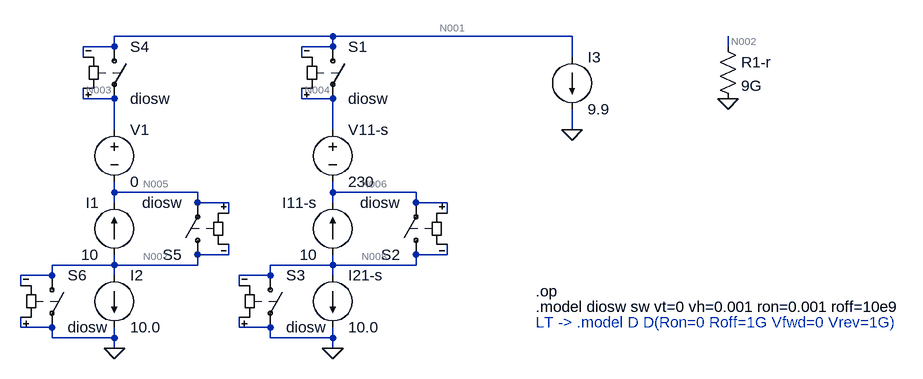
[diagram p0: schematic Generator-Test.asc]
Generator-Test.asc, the LTspice schematic file:
Version 4
SHEET 1 1272 680
WIRE 256 -64 -80 -64
WIRE 624 -64 256 -64
WIRE -80 -48 -80 -64
WIRE -80 -48 -128 -48
WIRE 256 -48 256 -64
WIRE 256 -48 208 -48
WIRE 864 -48 864 -64
WIRE -128 -32 -128 -48
WIRE 208 -32 208 -48
WIRE 624 -32 624 -64
WIRE -128 32 -128 16
WIRE -80 32 -128 32
WIRE 208 32 208 16
WIRE 256 32 208 32
WIRE -80 80 -80 32
WIRE 256 80 256 32
WIRE 624 80 624 48
WIRE -80 176 -80 160
WIRE 48 176 -80 176
WIRE 256 176 256 160
WIRE 384 176 256 176
WIRE -80 192 -80 176
WIRE 48 192 48 176
WIRE 96 192 48 192
WIRE 256 192 256 176
WIRE 384 192 384 176
WIRE 432 192 384 192
WIRE 96 208 96 192
WIRE 432 208 432 192
WIRE 96 272 96 256
WIRE 96 272 48 272
WIRE 432 272 432 256
WIRE 432 272 384 272
WIRE -80 288 -80 272
WIRE -80 288 -176 288
WIRE 48 288 48 272
WIRE 48 288 -80 288
WIRE 256 288 256 272
WIRE 256 288 160 288
WIRE 384 288 384 272
WIRE 384 288 256 288
WIRE -176 304 -176 288
WIRE -176 304 -224 304
WIRE -80 304 -80 288
WIRE 160 304 160 288
WIRE 160 304 112 304
WIRE 256 304 256 288
WIRE -224 320 -224 304
WIRE 112 320 112 304
WIRE -224 384 -224 368
WIRE -176 384 -224 384
WIRE 112 384 112 368
WIRE 160 384 112 384
WIRE -176 400 -176 384
WIRE -80 400 -80 384
WIRE -80 400 -176 400
WIRE 160 400 160 384
WIRE 256 400 256 384
WIRE 256 400 160 400
WIRE -80 416 -80 400
WIRE 256 416 256 400
FLAG 256 416 0
FLAG 624 80 0
FLAG -80 416 0
FLAG 864 32 0
DATAFLAG 384 -64 ""
SYMBOL current 256 272 R180
WINDOW 0 24 80 Left 2
WINDOW 3 24 0 Left 2
WINDOW 123 0 0 Left 0
WINDOW 39 0 0 Left 0
SYMATTR InstName I11-s
SYMATTR Value 10
SYMBOL voltage 256 64 R0
WINDOW 123 0 0 Left 0
WINDOW 39 0 0 Left 0
SYMATTR InstName V11-s
SYMATTR Value 230
SYMBOL current 256 304 R0
WINDOW 123 0 0 Left 0
WINDOW 39 0 0 Left 0
SYMATTR InstName I21-s
SYMATTR Value 10.0
SYMBOL res 848 -64 R0
SYMATTR InstName R1-r
SYMATTR Value 9G
SYMBOL sw 256 -64 R0
SYMATTR InstName S1
SYMATTR Value diosw
SYMBOL sw 384 288 R180
SYMATTR InstName S2
SYMATTR Value diosw
SYMBOL sw 160 288 R0
SYMATTR InstName S3
SYMATTR Value diosw
SYMBOL current -80 272 R180
WINDOW 0 24 80 Left 2
WINDOW 3 24 0 Left 2
WINDOW 123 0 0 Left 0
WINDOW 39 0 0 Left 0
SYMATTR InstName I1
SYMATTR Value 10
SYMBOL voltage -80 64 R0
WINDOW 123 0 0 Left 0
WINDOW 39 0 0 Left 0
SYMATTR InstName V1
SYMATTR Value 0
SYMBOL current -80 304 R0
WINDOW 123 0 0 Left 0
WINDOW 39 0 0 Left 0
SYMATTR InstName I2
SYMATTR Value 10.0
SYMBOL sw -80 -64 R0
SYMATTR InstName S4
SYMATTR Value diosw
SYMBOL sw 48 288 R180
SYMATTR InstName S5
SYMATTR Value diosw
SYMBOL sw -176 288 R0
SYMATTR InstName S6
SYMATTR Value diosw
SYMBOL current 624 -32 R0
WINDOW 123 0 0 Left 0
WINDOW 39 0 0 Left 0
SYMATTR InstName I3
SYMATTR Value 9.9
TEXT 568 328 Left 2 !.op
TEXT 568 352 Left 2 !.model diosw sw vt=0 vh=0.001 ron=0.001 roff=10e9
TEXT 568 376 Left 2 ;LT -> .model D D(Ron=0 Roff=1G Vfwd=0 Vrev=1G)

The netlist it stands for:
* Generator-Test.asc
I11-s N008 N006 10
V11-s N004 N006 230
I21-s N008 0 10.0
R1-r N002 0 9G
S1 N001 N004 N004 N001 diosw
S2 N008 N006 N006 N008 diosw
S3 N008 0 0 N008 diosw
I1 N007 N005 10
V1 N003 N005 0
I2 N007 0 10.0
S4 N001 N003 N003 N001 diosw
S5 N007 N005 N005 N007 diosw
S6 N007 0 0 N007 diosw
I3 N001 0 9.9
.op
.model diosw sw vt=0 vh=0.001 ron=0.001 roff=10e9
* LT -> .model D D(Ron=0 Roff=1G Vfwd=0 Vrev=1G)
.backanno
.end

* Results of the author's LTspice run, read from the files saved beside the schematic
* Operating Point:
*   V(n008) = -19.9 mV
*   V(n006) = -19.8 mV
*   V(n004) = 230 V
*   V(n002) = 0 V
*   V(n001) = 230 V
*   V(n007) = -10 mV
*   V(n005) = 46.45 pV
*   V(n003) = 46.45 pV
*   I(I3) = 9.9 A
*   I(I2) = 10 A
*   I(I1) = 10 A
*   I(I21-s) = 10 A
*   I(I11-s) = 10 A
*   I(R1-r) = 0 A
*   I(S6) = 10 A
*   I(S5) = 10 A
*   I(S4) = -23.23 nA
*   I(S3) = 19.9 A
*   I(S2) = 100 mA
*   I(S1) = 9.9 A
*   I(V1) = 23.23 nA
*   I(V11-s) = -9.9 A